# EasyEDA schematic Test Sled Rocket Schematic EasyEDA.json
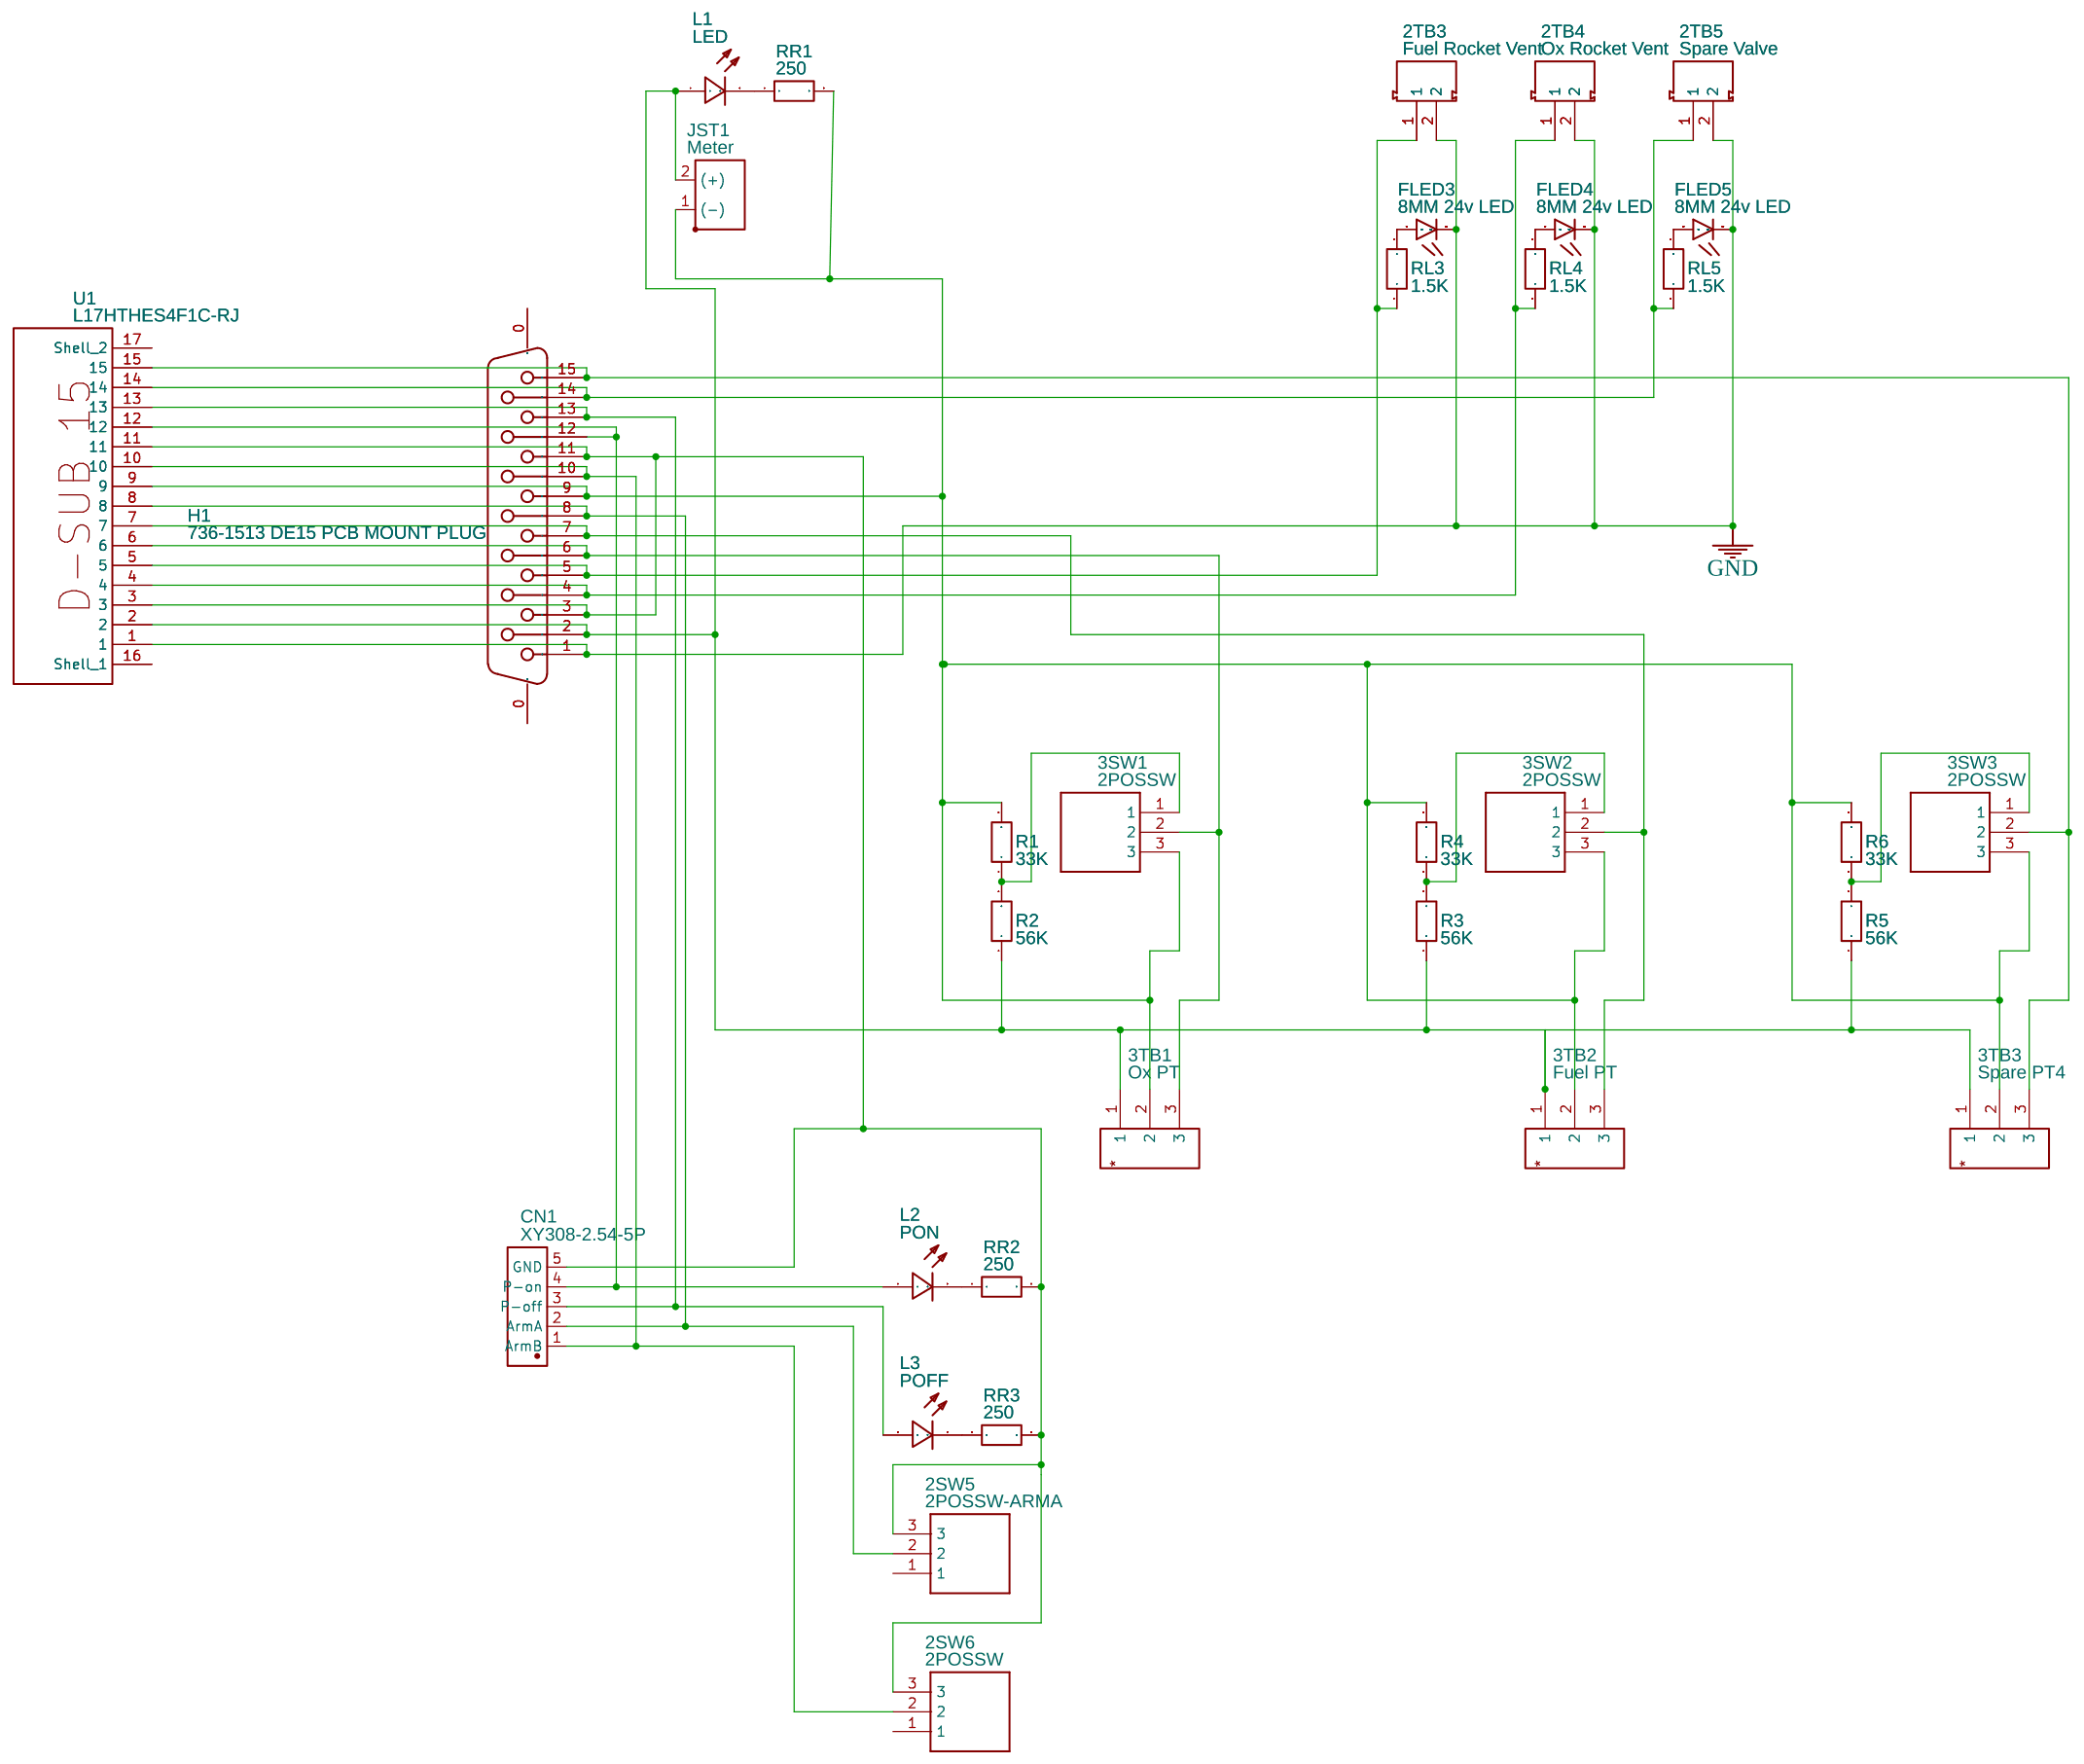
[diagram p0: schematic sheet]

## Parts
2SW5  2POSSW-ARMA  [MS13ANW03]
2SW6  2POSSW  [MS13ANW03]
2TB3  Fuel Rocket Vent  [1729128]
2TB4  Ox Rocket Vent  [1729128]
2TB5  Spare Valve  [1729128]
3SW1  2POSSW  [MS13ANW03]
3SW2  2POSSW  [MS13ANW03]
3SW3  2POSSW  [MS13ANW03]
3TB1  Ox PT  [SCREW_TERMINAL_5.08MM_3P]
3TB2  Fuel PT  [SCREW_TERMINAL_5.08MM_3P]
3TB3  Spare PT4  [SCREW_TERMINAL_5.08MM_3P]
CN1  XY308-2.54-5P  [CONN-TH_XY308-2.54-5P]
FLED3  8MM 24v LED  [LED8MM_MB]
FLED4  8MM 24v LED  [LED8MM_MB]
FLED5  8MM 24v LED  [LED8MM_MB]
H1  736-1513 DE15 PCB MOUNT PLUG  [736-1513 DE15 PCB MOUNT PLUG]
JST1  Meter  [JSTX2F]
L1  LED  [LED-DIP-3.8MM]
L2  PON  [LED-DIP-3.8MM]
L3  POFF  [LED-DIP-3.8MM]
R1  33K  [R0603]
R2  56K  [R0603]
R3  56K  [R0603]
R4  33K  [R0603]
R5  56K  [R0603]
R6  33K  [R0603]
RL3  1.5K  [R0603]
RL4  1.5K  [R0603]
RL5  1.5K  [R0603]
RR1  250  [R0603]
RR2  250  [R0603]
RR3  250  [R0603]
U1  L17HTHES4F1C-RJ  [L17HTHES4F1C-RJ]

## Library data of the parts
2SW5 2SW6 3SW1-3SW3 = MS12ANW03: Contributor: tenaah
2TB3-2TB5 = 1729128: Supplier: Digi-Key; Supplier Part: 277-1247-ND; Manufacturer: Phoenix Contact; Contributor: LCSC
3TB1-3TB3 = SCREW TERMINAL 3P: Manufacturer Part: 3 Pin Screw Terminal 5.08; Supplier Part: 146-8259; Supplier: RS-Online; link: https://uk.rs-online.com/web/p/pcb-terminal-blocks/1468259; Contributor: Richard Strofton
CN1 = XY308-2.54-5P: Supplier: LCSC; Supplier Part: C915914; Manufacturer: XINLAIYA(新莱亚); Contributor: LCSC; JLCPCB Part Class: Extended Part
FLED3-FLED5 = P804JPF4D: Mounted: No
H1 = 736-1513 DE15 PCB MOUNT PLUG: Manufacturer: Amphenol FCI; Manufacturer Part: 10090926-P154XLF; Supplier: RS-Online; Supplier Part: 736-1513; link: https://uk.rs-online.com/web/p/products/7361513/; Contributor: digitalradiohacker
JST1 = JST2X: Contributor: mbrinker
L1-L3 = -: Supplier: LCSC; Supplier Part: C331047; Manufacturer: TOGIALED; Manufacturer Part: TJ-L3FYTGHTCGSFLC6B-A5; Contributor: LCSC
R1-R6 RL3-RL5 RR1-RR3 = SFR03EZPF1001: Supplier: LCSC; Supplier Part: C2941038; Manufacturer: ROHM(罗姆); Contributor: lcsc
U1 = L17HTHES4F1C-RJ: Contributor: dropTarget

## Nets
GND: 2TB3.2 2TB4.2 2TB5.2 FLED3.CATHODE FLED4.CATHODE FLED5.CATHODE H1.1 U1.1
Net-(2SW5-2): 2SW5.2 CN1.2(ArmA) H1.8 U1.8
Net-(2SW5-3): 2SW5.3 2SW6.3 CN1.5(GND) H1.3 H1.11 RR2.2 RR3.2 U1.3 U1.11
Net-(2SW6-2): 2SW6.2 CN1.1(ArmB) H1.10 U1.10
Net-(2TB3-1): 2TB3.1 H1.5 RL3.1 U1.5
Net-(2TB4-1): 2TB4.1 H1.4 RL4.1 U1.4
Net-(2TB5-1): 2TB5.1 H1.14 RL5.1 U1.14
Net-(3SW1-1): 3SW1.1 R1.1 R2.2
Net-(3SW1-2): 3SW1.2 3TB1.3 H1.6 U1.6
Net-(3SW1-3): 3SW1.3 3SW2.3 3SW3.3 3TB1.2 3TB2.2 3TB3.2 H1.9 JST1.1((-)) R1.2 R4.2 R6.2 RR1.2 U1.9
Net-(3SW2-1): 3SW2.1 R3.2 R4.1
Net-(3SW2-2): 3SW2.2 3TB2.3 H1.7 U1.7
Net-(3SW3-1): 3SW3.1 R5.2 R6.1
Net-(3SW3-2): 3SW3.2 3TB3.3 H1.15 U1.15
Net-(3TB1-1): 3TB1.1 3TB2.1 3TB3.1 H1.2 JST1.2((+)) L1.1 R2.1 R3.1 R5.1 U1.2
Net-(CN1-3): CN1.3(P-off) H1.13 L3.1 U1.13
Net-(CN1-4): CN1.4(P-on) H1.12 L2.1 U1.12
Net-(FLED3-ANODE): FLED3.ANODE RL3.2
Net-(FLED4-ANODE): FLED4.ANODE RL4.2
Net-(FLED5-ANODE): FLED5.ANODE RL5.2
Net-(L1-2): L1.2 RR1.1
Net-(L2-2): L2.2 RR2.1
Net-(L3-2): L3.2 RR3.1

Not connected (* = marked no-connect by the designer): 2SW5 1; 2SW6 1; H1 0; U1 16(Shell 1) 17(Shell 2)
